# EAGLE board Seeeduino GPRS v1.0 (EAGLE 6.4)
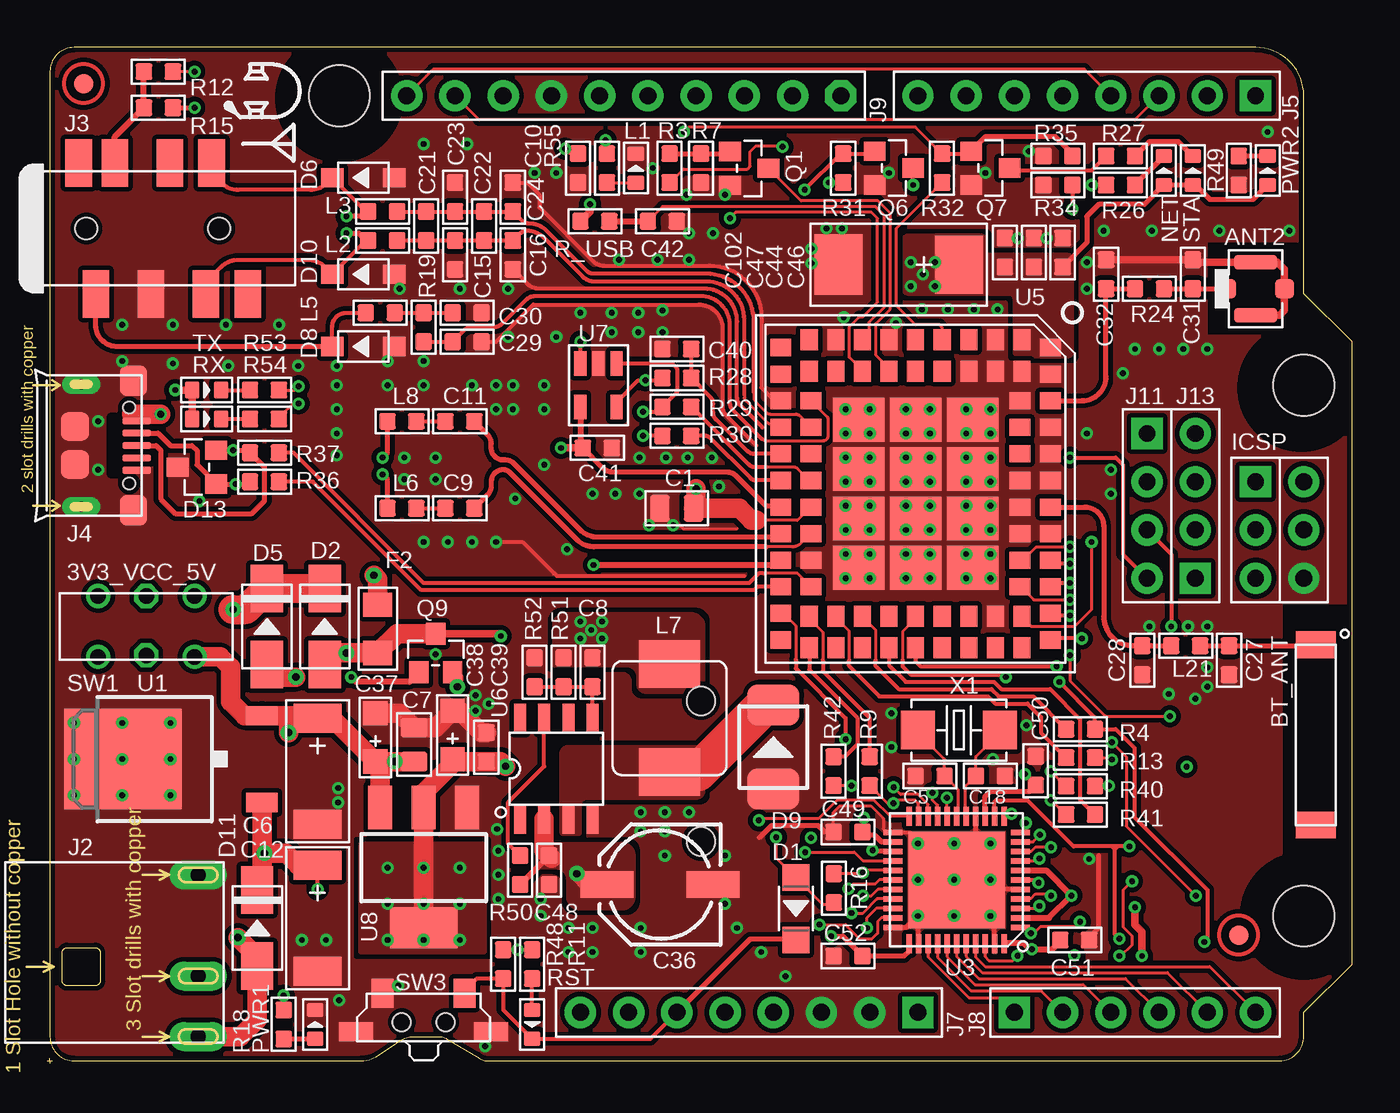
[diagram p3: board, top side]
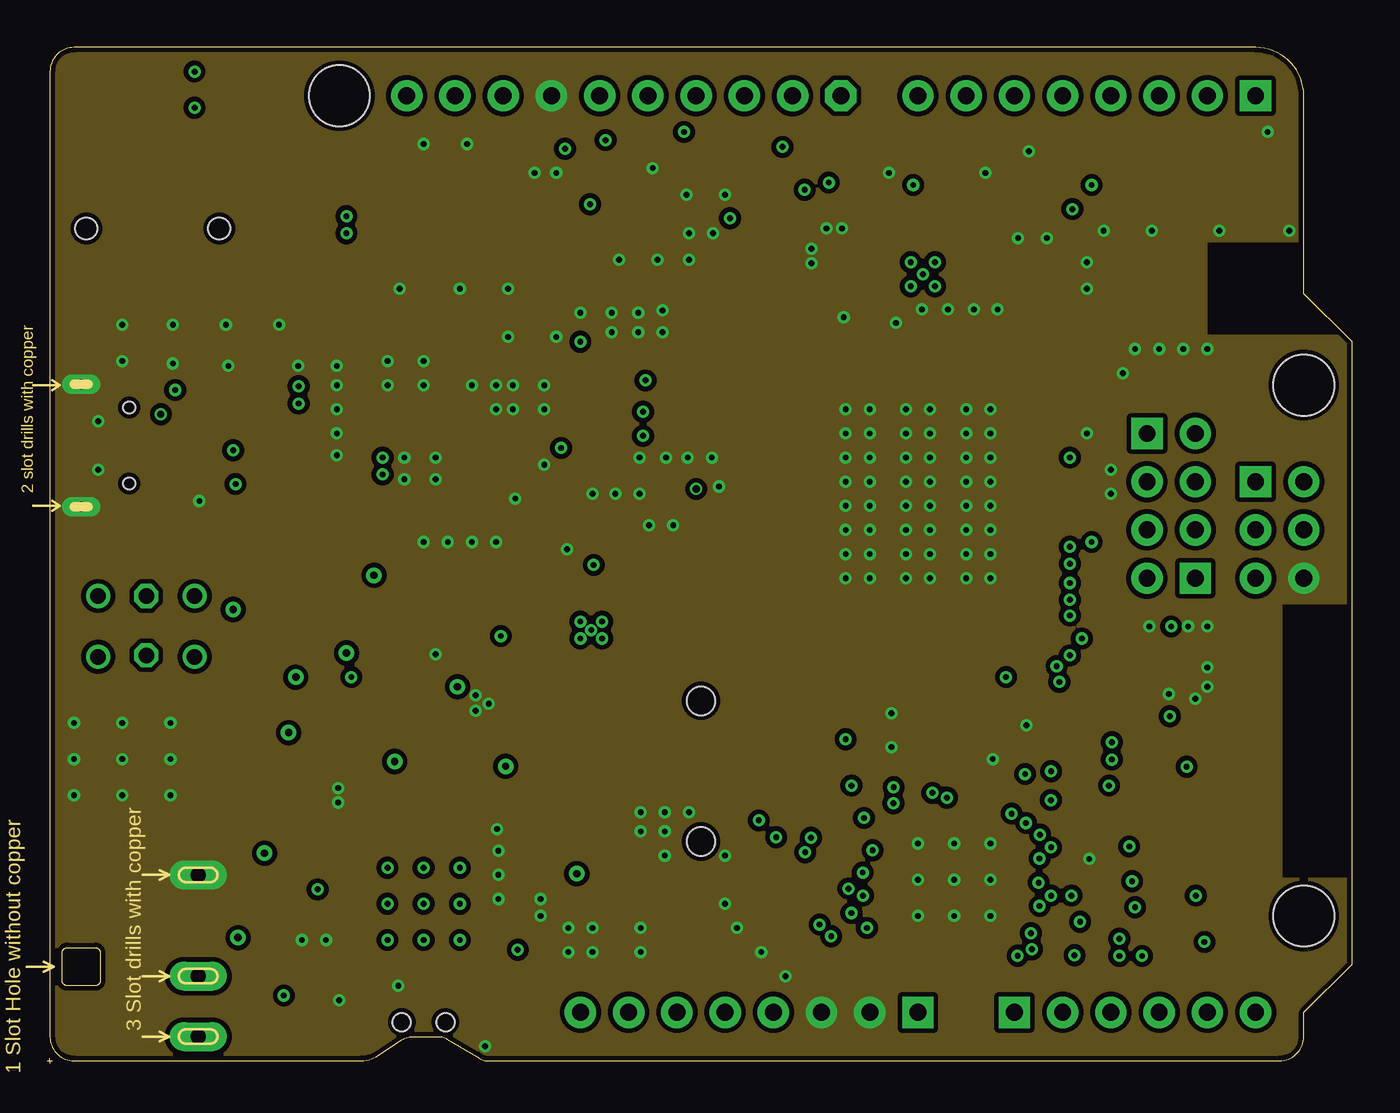
[diagram p4: board, inner layer GND]
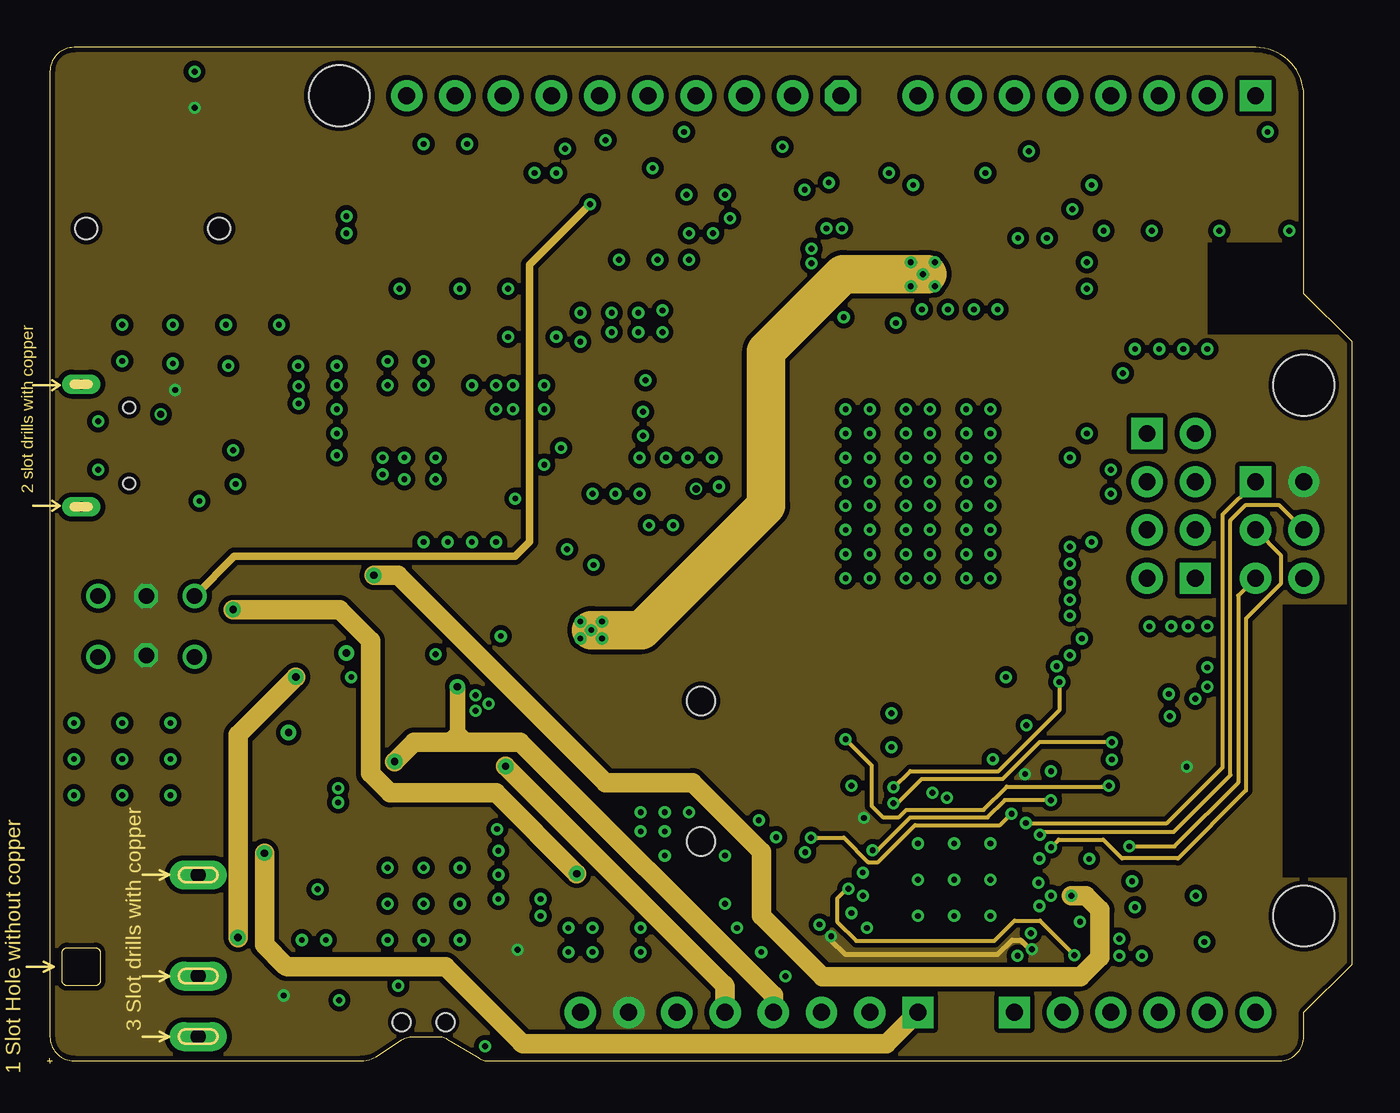
[diagram p5: board, inner layer VCC]
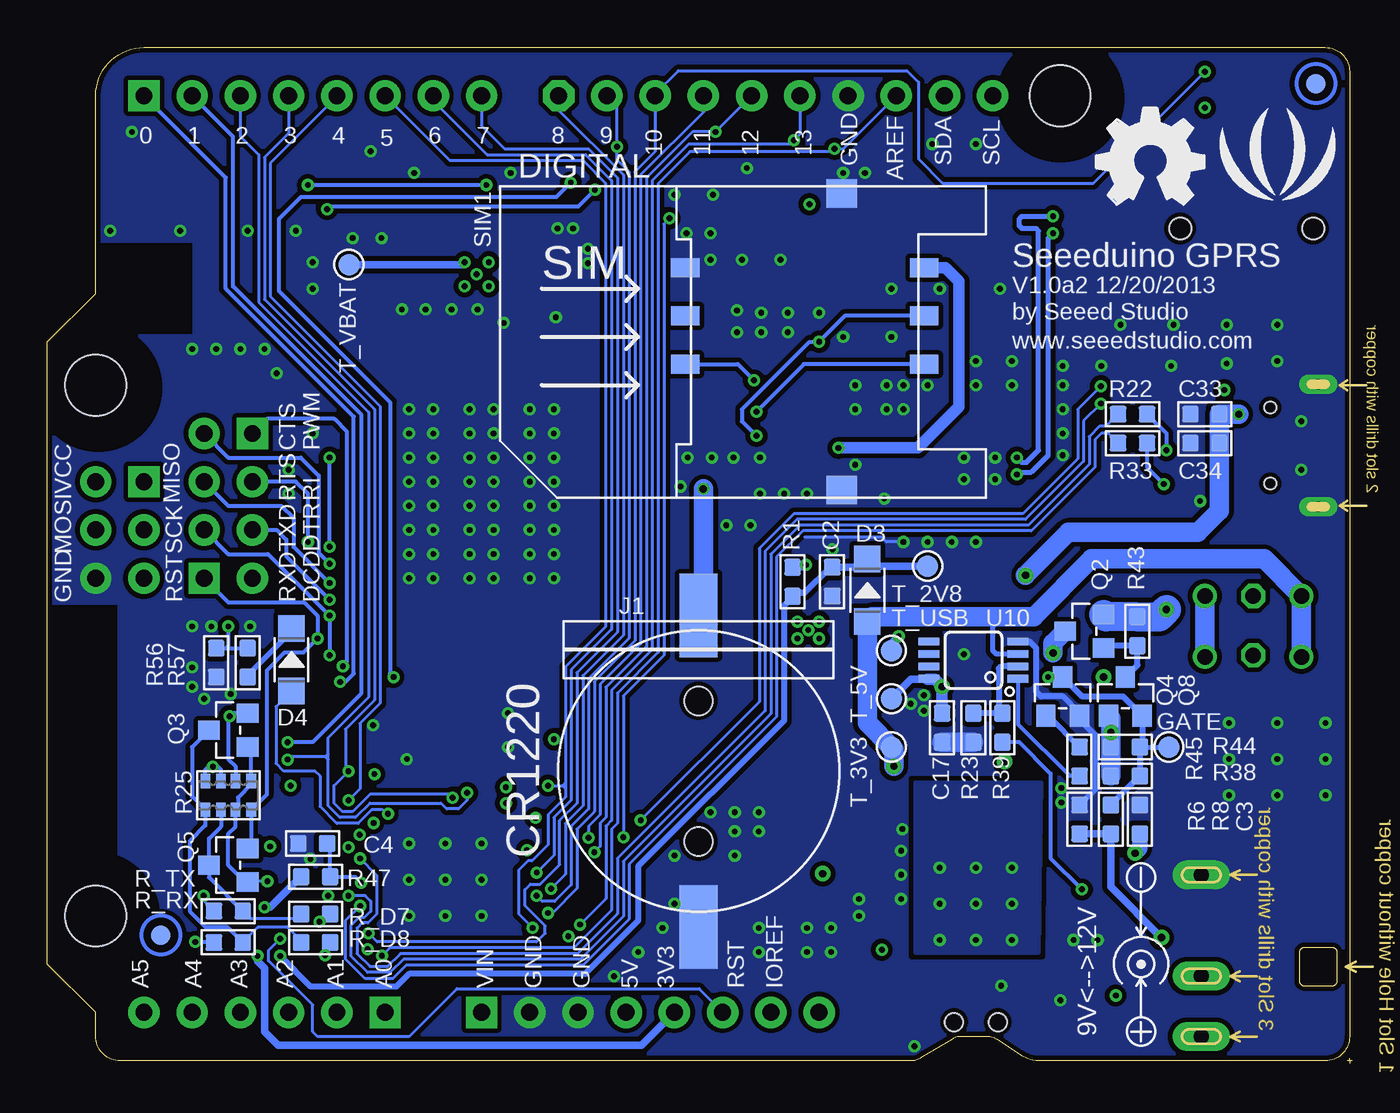
[diagram p6: board, bottom side, seen from below]

Size 68.71 x 53.47 mm. Coordinates in mm from the lower left corner, seen from the top.
Outline: 0.13,52.2 0.13,1.4
Outline: 0.13,1.4 arc90 1.4,0.13
Outline: 1.4,0.13 16.53,0.13 arc34 17.43,0.4 18.65,1.21 arc-34 19.25,1.4 20.57,1.4 arc-30 21.05,1.26 22.64,0.34 arc30 23.03,0.13 64.9,0.13
Outline: 64.9,0.13 arc90 66.17,1.4
Outline: 66.17,1.4 66.17,2.67 68.71,5.21 68.71,37.97 66.17,40.51 66.17,50.93
Outline: 66.17,50.93 arc90 63.63,53.47
Outline: 63.63,53.47 1.4,53.47
Outline: 1.4,53.47 arc90 0.13,52.2
Outline: 0.13,1.4 arc90 1.4,0.13
Outline: 64.9,0.13 arc90 66.17,1.4
Outline: 66.17,50.93 arc90 63.63,53.47
Outline: 1.4,53.47 arc90 0.13,52.2
Outline: 0,0.13 0.13,0.13
Outline: 0.13,0.13 0.25,0.13
Outline: 0.13,0.13 0.13,0.25
Outline: 0.13,0.13 0.13,0
Copper layers (1*2*15*16): Top 0.035mm / dielectric 0.2mm / GND 0.0175mm / dielectric 0.3mm / VCC 0.0175mm / dielectric 0.2mm / Bottom 0.035mm
Design rules "SeeedStudio_4layer_DRU_no_angle_20140221 *": minimum track width 4mil, minimum drill 0.2mm, track to track 6mil, track to pad 6mil, pad to pad 6mil, via to via 6mil, smd to smd 0mil, copper to edge 8mil, drill to drill 8mil, minimum pad ring 6mil, minimum via ring 4mil, stop-mask expansion 4mil, vias tented up to drill 100mil, thermal gap 10mil
Net classes: 0 default: width 0.152 mm, drill 0.305 mm, clearance 0.152 mm; 3 none3: width 0.203 mm, drill 0.305 mm, clearance 0.203 mm
Holes 3.2 mm at 15.37,50.93 66.17,35.69 66.17,7.75
tRestrict: area 63.1,4.7 to 69.2,10.8; area 63,32.5 to 69.1,38.6; area 12.3,47.8 to 18.4,53.8
bRestrict: area 12.3,47.8 to 18.4,53.8; area 63,32.5 to 69.1,38.6; area 63.1,4.7 to 69.2,10.8

## Footprints (pad centres in the part's own frame; a part is rotated, then mirrored left to right if it is on the bottom)
4P-U-FL = smd 1.016 x 1.016: D -1.524,0; GND3 1.524,0 | smd 2.286 x 0.762: GND1 0,1.397; GND2 0,-1.397
2P-9.5X2.1X1MM = smd 1.4 x 2.1: 1 -4.75,0; 2 4.75,0
C0805 = smd 1.016 x 1.397: 1 -0.889,0; 2 0.889,0
C0603 = smd 0.889 x 0.889: 1 -0.762,0; 2 0.762,0
AVX-C = smd 1.524 x 2.54: + -2.794,0; - 2.794,0
ELECTRO-SMD-D-5.6MM = smd 2.794 x 1.397: + 2.794,0; - -2.794,0
AVX-A = smd 1.27 x 1.27: + -1.27,0; - 1.27,0
AVX-D = smd 2.54 x 3.048: + -3.175,0 | smd 2.54 x 3.175: - 3.175,0
SOD123 = smd 1.397 x 1.397: + -1.651,0; - 1.651,0
SMA = smd 2.5 x 1.7: 1 2,0; 2 -2,0
SOD123-2.7X1.6 = smd 1.2 x 1.02: 1 -1.635,0; 2 1.635,0
SMB = smd 2.159 x 2.743: + -2.21,0; - 2.21,0
SOT23 = smd 1.016 x 1.143: 1 -0.889,-1.016; 2 0.889,-1.016; 3 0,1.016
1206 = smd 1.27 x 1.524: 1 -1.27,0; 2 1.27,0
TP_4545 = smd 1.143 x 1.143: T 0,0
2X3P-2.54 = drill 0.889 pad 1.651 square: 1 -1.27,2.54 | drill 0.889 pad 1.651: 2 -1.27,0; 3 -1.27,-2.54; 4 1.27,-2.54; 5 1.27,0; 6 1.27,2.54
SMD-CR1220-2 = smd 2 x 4.4: + 0,-8.2; - 0,8.2 | hole 1.5: 0,3.7; 0,-3.7
DC-404 = drill 0.813 pad 1.524 long: + 3.175,10.16; - -5.334,10.16; CDN 0,10.16
8P-3.5-SMD = smd 1.4 x 2.5: 1 2.8,-3.45; 2 5.7,-3.45; 3 8.6,-3.45; 4 8.9,3.45; 5 1.9,3.45; 6 3.8,3.45; 7 6.7,3.45; 8 10.8,-3.45 | hole 1.149: 2.3,0; 9.3,0
MICRO-USB = smd 0.381 x 1.524: 1 -1.3,-0.25; 2 -0.65,-0.25; 3 0,-0.25; 4 0.65,-0.25; 5 1.3,-0.25 | smd 1.6 x 1.397: S1 -3.4,-0.427; S6 3.4,-0.427 | drill 0.508 pad 1.016 long: S2 -3.226,-3.175; S5 3.226,-3.175 | smd 1.5 x 1.5: S3 -1,-3.5; S4 1,-3.5 | hole 0.635: -2,-0.65; 2,-0.65
8P-2.54-65/35MIL = drill 0.889 pad 1.651 square: 1 0,8.89 | drill 0.889 pad 1.651: 2 0,6.35; 3 0,3.81; 4 0,1.27; 5 0,-1.27; 6 0,-3.81; 7 0,-6.35; 8 0,-8.89
6P-2.54-65/35MIL = drill 0.889 pad 1.651 square: 1 0,6.35 | drill 0.889 pad 1.651: 2 0,3.81; 3 0,1.27; 4 0,-1.27; 5 0,-3.81; 6 0,-6.35
10P-2.54 = drill 0.889 pad 1.651 octagon: 1 0,11.43 | drill 0.889 pad 1.651: 2 0,8.89; 3 0,6.35; 4 0,3.81; 5 0,1.27; 6 0,-1.27; 7 0,-3.81; 8 0,-6.35; 9 0,-8.89; 10 0,-11.43
4P-65/35MIL = drill 0.889 pad 1.651 square: 1 0,3.81 | drill 0.889 pad 1.651: 2 0,1.27; 3 0,-1.27; 4 0,-3.81
LED-0603 = smd 0.762 x 0.889: + -0.762,0; - 0.762,0
L0603 = smd 0.889 x 0.889: 1 -0.762,0; 2 0.762,0
L0630 = smd 2.5 x 3.2: 1 -2.85,0; 2 2.85,0
R0603 = smd 0.889 x 0.889: 1 -0.762,0; 2 0.762,0
ROUND-MARK-1.0 = smd 1.016 x 1.016: P$1 0,0
1206-8-3.3X2.4 = smd 0.508 x 0.762: 1 -1.206,-0.762; 2 -0.381,-0.762; 3 0.381,-0.762; 4 1.206,-0.762; 5 1.206,0.762; 6 0.381,0.762; 7 -0.381,0.762; 8 -1.206,0.762
6P-1.8 = smd 1.5 x 1: 1 -6.3,-3.9; 2 -6.3,-1.36; 3 -6.3,1.18; 4 6.3,1.18; 5 6.3,-1.36; 6 6.3,-3.9 | smd 1.6 x 1.5: P1 -1.95,-7.8; P2 -1.95,7.8
6P-2CH-2.5-9.1X3.5X3.2H = drill 0.813 pad 1.27: CH1A -2.54,-1.6; CH1B 2.54,-1.6; CH2A -2.54,1.6; CH2B 2.54,1.6 | drill 0.813 pad 1.27 octagon: COM1 0,-1.6; COM2 0,1.524
4P-SMD-7X3.5X3.5H = smd 1.143 x 1.524: 1 -2.159,1.524; 2 2.159,1.524 | smd 1.778 x 1.016: S1 -3.556,-0.508; S2 3.556,-0.508 | hole 0.95: -1.15,0; 1.15,0
TO252 = smd 1.016 x 1.651: 1 -2.286,-4.826; 2 2.286,-4.826 | smd 5.3 x 6.2: 3 0,2.5
QFN44 = smd 1 x 0.3: 1 -3.35,2.5; 2 -3.35,2; 3 -3.35,1.5; 4 -3.35,1; 5 -3.35,0.5; 6 -3.35,0; 7 -3.35,-0.5; 8 -3.35,-1; 9 -3.35,-1.5; 10 -3.35,-2; 11 -3.35,-2.5; 23 3.35,-2.5; 24 3.35,-2; 25 3.35,-1.5; 26 3.35,-1; 27 3.35,-0.5; 28 3.35,0; 29 3.35,0.5; 30 3.35,1; 31 3.35,1.5; 32 3.35,2; 33 3.35,2.5 | smd 0.3 x 1: 12 -2.5,-3.35; 13 -2,-3.35; 14 -1.5,-3.35; 15 -1,-3.35; 16 -0.5,-3.35; 17 0,-3.35; 18 0.5,-3.35; 19 1,-3.35; 20 1.5,-3.35; 21 2,-3.35; 22 2.5,-3.35; 34 2.5,3.35; 35 2,3.35; 36 1.5,3.35; 37 1,3.35; 38 0.5,3.35; 39 0,3.35; 40 -0.5,3.35; 41 -1,3.35; 42 -1.5,3.35; 43 -2,3.35; 44 -2.5,3.35 | smd 5.08 x 5.08: TAB 0,0
88P-17.8X15.8X2.4H = smd 1.1 x 0.9: 1 -8.1,5.6; 2 -8.1,4.2; 3 -8.1,2.8; 4 -8.1,1.4; 5 -8.1,0; 6 -8.1,-1.4; 7 -8.1,-2.8; 8 -8.1,-4.2; 9 -8.1,-5.6; 22 8.1,-5.6; 23 8.1,-4.2; 24 8.1,-2.8; 25 8.1,-1.4; 26 8.1,0; 27 8.1,1.4; 28 8.1,2.8; 29 8.1,4.2; 30 8.1,5.6; 43 -6.45,5.6; 44 -6.45,4.2; 45 -6.45,2.8; 46 -6.45,1.4; 47 -6.45,0; 48 -6.45,-1.4; 49 -6.45,-2.8; 50 -6.45,-4.2; 51 -6.45,-5.6; 60 6.45,-5.6; 61 6.45,-4.2; 62 6.45,-2.8; 63 6.45,-1.4; 64 6.45,0; 65 6.45,1.4; 66 6.45,2.8; 67 6.45,4.2; 68 6.45,5.6 | smd 0.9 x 1.1: 10 -7.7,-7.1; 11 -6.3,-7.1; 12 -4.9,-7.1; 13 -3.5,-7.1; 14 -2.1,-7.1; 15 -0.7,-7.1; 16 0.7,-7.1; 17 2.1,-7.1; 18 3.5,-7.1; 19 4.9,-7.1; 20 6.3,-7.1; 21 7.7,-7.1; 31 7.7,7.1; 32 6.3,7.1; 33 4.9,7.1; 34 3.5,7.1; 35 2.1,7.1; 36 0.7,7.1; 37 -0.7,7.1; 38 -2.1,7.1; 39 -3.5,7.1; 40 -4.9,7.1; 41 -6.3,7.1; 42 -7.7,7.1; 52 -4.9,-5.5; 53 -3.5,-5.5; 54 -2.1,-5.5; 55 -0.7,-5.5; 56 0.7,-5.5; 57 2.1,-5.5; 58 3.5,-5.5; 59 4.9,-5.5; 69 4.9,5.5; 70 3.5,5.5; 71 2.1,5.5; 72 0.7,5.5; 73 -0.7,5.5; 74 -2.1,5.5; 75 -3.5,5.5; 76 -4.9,5.5 | smd 2.3 x 2.7: 77 -3.9,3; 78 -3.9,0; 79 -3.9,-3; 80 -1.3,-3; 81 1.3,-3; 82 3.9,-3; 83 3.9,0; 84 3.9,3; 85 1.3,3; 86 -1.3,3; 87 -1.3,0; 88 1.3,0
SOP8 = smd 0.635 x 1.524: 1 -1.905,-2.667; 2 -0.635,-2.667; 3 0.635,-2.667; 4 1.905,-2.667; 5 1.905,2.667; 6 0.635,2.667; 7 -0.635,2.667; 8 -1.905,2.667
SOT23-5L = smd 0.65 x 1.3: 1 0,1.15; 2 0.95,1.15; 3 1.9,1.15; 4 1.9,-1.15; 5 0,-1.15
SOT-223 = smd 1.27 x 2.286: 1 -2.286,-3.175; 2 0,-3.175; 3 2.286,-3.175 | smd 3.556 x 2.159: TER 0,3.175
MSOP8 = smd 1.1 x 0.4: 1 -2.477,0.975; 2 -2.477,0.325; 3 -2.477,-0.325; 4 -2.477,-0.975; 5 2.223,-0.975; 6 2.223,-0.325; 7 2.223,0.325; 8 2.223,0.975
2P-SMD-5X3.2 = smd 1.778 x 2.032: 1 -2.159,0; 2 2.159,0

## Placement (x,y rotation side)
ANT2  APZ01  [4P-U-FL]  63.63,40.77 0 top
BT_ANT  AN9520  [2P-9.5X2.1X1MM]  66.8,17.27 270 top
C1  4.7uF  [C0805]  33.15,29.21 0 top
C2  100nF  [C0603]  27.38,25.35 90 bottom
C3  100nF  [C0603]  11.18,12.83 270 bottom
C4  1uF  [C0603]  54.74,11.56 0 bottom
C5  8.2pF  [C0603]  46.48,15.11 0 top
C6  16v_47uF  [AVX-C]  14.22,15.37 270 top
C7  25V_10uF  [C0805]  19.3,16.76 90 top
C8  DNP  [C0603]  28.7,20.57 90 top
C9  39pF  [C0603]  21.72,29.21 180 top
C10  100nF  [C0603]  27.94,47.12 90 top
C11  39pF  [C0603]  21.72,33.78 180 top
C12  16v_47uF  [AVX-C]  14.22,7.62 270 top
C15  8.2pF  [C0603]  21.46,42.55 90 top
C16  39pF  [C0603]  24.51,42.55 90 top
C17  100nF  [C0603]  21.59,17.65 270 bottom
C18  8.2pF  [C0603]  49.66,15.11 180 top
C21  8.2pF  [C0603]  19.94,44.07 90 top
C22  39pF  [C0603]  22.99,44.07 90 top
C23  8.2pF  [C0603]  21.46,45.59 90 top
C24  39pF  [C0603]  24.51,45.59 90 top
C27  1.5pF  [C0603]  62.23,21.21 90 top
C28  DNP  [C0603]  57.66,21.21 90 top
C29  39pF  [C0603]  22.1,37.97 0 top
C30  39pF  [C0603]  22.1,39.5 180 top
C31  DNP  [C0603]  60.33,41.53 270 top
C32  DNP  [C0603]  55.75,41.53 270 top
C33  100nF  [C0603]  7.75,34.16 180 bottom
C34  10nF  [C0603]  7.75,32.64 180 bottom
C36  220uF_16V  [ELECTRO-SMD-D-5.6MM]  32.26,9.4 180 top
C37  DNP  [AVX-A]  17.27,17.14 90 top
C38  16V_10uF  [AVX-A]  21.34,17.27 90 top
C39  100nF  [C0603]  23.11,16.64 90 top
C40  22pF  [C0603]  33.15,37.59 0 top
C41  1uF  [C0603]  28.96,32.39 180 top
C42  1uF  [C0603]  32.39,44.32 180 top
C44  DNP  [C0603]  51.94,42.67 270 top
C46  DNP  [C0603]  53.47,42.67 270 top
C47  DNP  [C0603]  50.42,42.67 270 top
C48  100nF  [C0603]  26.42,10.16 90 top
C49  100nF  [C0603]  42.16,12.17 0 top
C50  100nF  [C0603]  52.04,15.39 270 top
C51  100nF  [C0603]  54.1,6.48 180 top
C52  100nF  [C0603]  42.16,5.64 0 top
C102  470uF_6.3V  [AVX-D]  44.83,42.04 180 top
D1  MBR0520LT1G  [SOD123]  39.42,8.13 270 top
D2  DNP  [SMA]  14.61,22.99 90 top
D3  DNP  [SOD123]  25.53,24.89 90 bottom
D4  MBR0520LT1G  [SOD123]  55.85,21.23 90 bottom
D5  1N5819  [SMA]  11.56,22.99 90 top
D6  CESD5V0D1  [SOD123-2.7X1.6]  16.64,46.61 180 top
D8  CESD5V0D1  [SOD123-2.7X1.6]  16.64,37.72 180 top
D9  SS54  [SMB]  38.23,16.64 90 top
D10  CESD5V0D1  [SOD123-2.7X1.6]  16.64,41.53 180 top
D11  1N5819  [SMA]  11.05,7.11 90 top
D13  CESD3V3AP  [SOT23]  7.87,31.37 90 top
F2  PPTC-500mA  [1206]  17.4,22.86 270 top
GATE  DNP  [TP_4545]  9.65,16.64 0 bottom
ICSP  2.54-2x3p male  [2X3P-2.54]  64.9,28.07 0 top
J1  CR1220  [SMD-CR1220-2]  34.42,15.37 180 bottom
J2  DC-044-AH  [DC-404]  -2.22,4.57 270 top
J3  8P-3.5mm-SMD  [8P-3.5-SMD]  -0.25,43.94 0 top
J4  MICRO-B-SMD_340005001  [MICRO-USB]  4.95,32.51 270 top
J5  HEADER-8P-65/35MIL  [8P-2.54-65/35MIL]  54.74,50.93 270 top
J7  HEADER-8P-65/35MIL  [8P-2.54-65/35MIL]  36.96,2.67 270 top
J8  HEADER-6P-65/35MIL  [6P-2.54-65/35MIL]  57.28,2.67 90 top
J9  HEADER-10P-2.54  [10P-2.54]  30.35,50.93 270 top
J11  DNP  [4P-65/35MIL]  57.91,29.34 0 top
J13  DNP  [4P-65/35MIL]  60.45,29.34 180 top
L1  GREEN  [LED-0603]  30.99,47.12 90 top
L2  120R_500mA  [L0603]  17.65,43.31 180 top
L3  120R_500mA  [L0603]  17.65,44.83 180 top
L5  120R_500mA  [L0603]  17.53,39.5 180 top
L6  68nH  [L0603]  18.67,29.21 180 top
L7  10uH  [L0630]  32.77,18.16 90 top
L8  68nH  [L0603]  18.67,33.78 180 top
L21  1.2nH  [R0603]  59.94,21.97 180 top
NET  RED  [LED-0603]  58.8,46.99 90 top
P5  DNP  [ROUND-MARK-1.0]  1.91,51.56 0 top
P6  DNP  [ROUND-MARK-1.0]  62.74,6.73 0 top
P7  DNP  [ROUND-MARK-1.0]  62.74,6.73 0 bottom
P8  DNP  [ROUND-MARK-1.0]  1.91,51.56 0 bottom
PWR1  GREEN  [LED-0603]  14.1,2.03 90 top
PWR2  GREEN  [LED-0603]  64.26,46.99 90 top
Q1  S9013  [SOT23]  36.96,47.1 270 top
Q2  NCE3407A  [SOT23]  14.1,22.73 90 bottom
Q3  2N7002  [SOT23]  59.18,17.53 90 bottom
Q4  2N7002  [SOT23]  15.24,19.3 0 bottom
Q5  2N7002  [SOT23]  59.18,10.41 90 bottom
Q6  S9013  [SOT23]  44.58,47.12 270 top
Q7  S9013  [SOT23]  49.66,47.12 270 top
Q8  2N7002  [SOT23]  11.94,19.3 0 bottom
Q9  NCE3407A  [SOT23]  20.45,21.59 0 top
R1  0R  [R0603]  29.46,25.34 90 bottom
R3  4.7K  [R0603]  32.77,47.12 90 top
R4  DNP  [R0603]  54.41,17.58 180 top
R6  1M  [R0603]  14.35,12.83 270 bottom
R7  100k  [R0603]  34.42,47.12 90 top
R8  DNP  [R0603]  12.7,12.83 270 bottom
R9  DNP  [R0603]  43.31,15.37 90 top
R11  1k  [R0603]  25.53,5.21 270 top
R12  DNP  [R0603]  5.84,52.2 0 top
R13  DNP  [R0603]  54.41,16.08 180 top
R15  DNP  [R0603]  5.84,50.29 180 top
R16  DNP  [R0603]  41.41,9.21 90 top
R18  1k  [R0603]  12.45,2.03 270 top
R19  68R  [R0603]  19.81,38.73 90 top
R22  0R  [R0603]  11.56,34.16 180 bottom
R23  100k  [R0603]  19.94,17.65 90 bottom
R24  0R  [R0603]  58.04,40.77 180 top
R25  4.7k  [1206-8-3.3X2.4]  59.18,14.1 0 bottom
R26  470R  [R0603]  56.52,46.23 180 top
R27  470R  [R0603]  56.52,47.75 180 top
R28  22R  [R0603]  33.15,36.07 0 top
R29  22R  [R0603]  33.15,34.54 180 top
R30  22R  [R0603]  33.15,33.02 180 top
R31  4.7K  [R0603]  41.91,47.12 270 top
R32  4.7K  [R0603]  47.12,47.12 270 top
R33  0R  [R0603]  11.56,32.64 180 bottom
R34  100k  [R0603]  53.21,46.23 180 top
R35  100k  [R0603]  53.21,47.75 180 top
R36  DNP  [R0603]  11.43,30.61 180 top
R37  DNP  [R0603]  11.43,32.13 180 top
R38  100k  [R0603]  11.94,15.11 180 bottom
R39  100k  [R0603]  18.41,17.65 270 bottom
R40  DNP  [R0603]  54.41,14.58 0 top
R41  DNP  [R0603]  54.41,13.08 0 top
R42  DNP  [R0603]  41.4,15.37 90 top
R43  100k  [R0603]  11.3,22.73 90 bottom
R44  100k  [R0603]  11.94,16.64 180 bottom
R45  1k  [R0603]  14.35,15.88 270 bottom
R47  DNP  [R0603]  54.58,9.8 0 bottom
R48  10K  [R0603]  24,5.21 270 top
R49  1k  [R0603]  62.74,46.99 90 top
R50  100k  [R0603]  24.89,10.16 270 top
R51  24k_1%  [R0603]  27.18,20.57 270 top
R52  10k_1%  [R0603]  25.65,20.57 90 top
R53  1k  [R0603]  11.43,35.43 180 top
R54  1k  [R0603]  11.43,33.91 180 top
R55  1k  [R0603]  29.46,47.12 90 top
R56  10K  [R0603]  59.82,21.08 90 bottom
R57  4.7K  [R0603]  58.17,21.08 270 bottom
R_D7  0R  [R0603]  54.58,7.85 180 bottom
R_D8  0R  [R0603]  54.58,6.35 180 bottom
R_RX  DNP  [R0603]  59.18,6.35 0 bottom
R_TX  DNP  [R0603]  59.18,8 0 bottom
R_USB  DNP  [R0603]  28.83,44.32 180 top
RST  RED  [LED-0603]  25.53,2.03 270 top
RX  RED  [LED-0603]  8.38,33.91 0 top
SIM1  ST-SIM-004B  [6P-1.8]  28.83,37.97 180 bottom
STA  GREEN  [LED-0603]  60.33,46.99 90 top
SW1  SWITCH-2CH-6P  [6P-2CH-2.5-9.1X3.5X3.2H]  5.21,22.99 180 top
SW3  BUTTON-4P-REINFORCE'TS-118E'  [4P-SMD-7X3.5X3.5H]  19.81,2.16 0 top
T_2V8  DNP  [TP_4545]  22.35,26.16 90 bottom
T_3V3  DNP  [TP_4545]  24.26,16.64 90 bottom
T_5V  DNP  [TP_4545]  24.26,19.18 90 bottom
T_USB  DNP  [TP_4545]  24.26,21.72 0 bottom
T_VBAT  DNP  [TP_4545]  52.83,42.04 90 bottom
TX  RED  [LED-0603]  8.38,35.43 0 top
U1  CJ78M05  [TO252]  6.48,16 90 top
U3  ATMEGA32U4-MUR  [QFN44]  47.88,9.64 180 top
U5  SIM800H  [88P-17.8X15.8X2.4H]  45.72,29.97 270 top
U6  TD1410  [SOP8]  26.8,15.49 0 top
U7  ESDA6V1SC5  [SOT23-5L]  28.07,35.69 0 top
U8  CJT1117-3.3  [SOT-223]  19.81,10.29 180 top
U10  LMV358DGKR  [MSOP8]  20.07,21.21 180 bottom
U$36  [LOGO_SILK]  3.94,47.12 0 bottom
U$42  [OSHW_FILLX200_NOTEXT]  13.46,45.21 0 bottom
X1  16MHz  [2P-SMD-5X3.2]  48.01,17.53 180 top

## Tracks (layer width: path | path; a pad name or v marks a point on that pad's centre or on a via)
3V3  (via drill 0.3 pad 0.64, 0.38 pad 0.81)
  Top 0.406: v57.65,5.64 57.65,6.92 57.28,7.29 v57.28,8.2
  Top 1.016: U8.TER U8.2 19.81,14.22 21.34,15.75 C38.+ 21.46,15.88 C39.1 23.88,15.88 v24.13,15.62
  VCC 1.016: v24.13,15.62 35.61,4.14 arc-45 35.69,3.96 J7.5
  Bottom 0.254: U10.3 18.74,21.53 18.92,21.72 18.92,22.99 | 18.92,22.99 18.92,23.37 18.8,23.49 | 18.92,22.99 18.67,23.24 | 18.92,22.99 19.18,23.24
  Bottom 0.406: J7.5 37.43,0.93 56.55,0.93 57.28,1.65 57.28,4.98 57.65,5.35 v57.65,5.64 | R47.1 55.37,9.8 56.97,8.2 v57.28,8.2
  Bottom 1.016: v24.13,15.62 24.13,16.51 T_3V3.T 25.53,17.91 D3.+ 25.27,23.49 18.8,23.49 16.76,23.49 13.72,26.54 4.62,26.54 SW1.CH1B SW1.CH2B
  other vias: 19.81,6.48 19.81,8.38 19.81,10.29 21.72,10.29 21.72,8.38 21.72,6.48 17.91,6.48 17.91,8.38 17.91,10.29
  pour Top (isolate 0.254, no thermals): 16.51,11.56 22.99,11.56 22.99,5.84 16.51,5.84
  pour Bottom (isolate 0.254, no thermals): 16.38,14.73 22.99,14.73 22.99,5.84 16.51,5.84
!RES  (via drill 0.3 pad 0.64)
  Top 0.152: U5.49 42.92,36.46 42.23,37.15 42.23,38.76 42.77,39.29 42.95,39.29 43.71,40.06 43.71,44.48 43.41,44.78 36.25,44.78 v35.94,44.48 | 41.19,8.45 R16.1 41.33,8.36 40.82,8.36 39.42,9.75 D1.+ | D1.+ 39.4,9.78 | v38.38,11.89 38.38,10.82 D1.+
  Bottom 0.152: v35.94,44.48 36.25,44.17 36.25,21.46 38.38,19.33 v38.38,11.89
!RESET  (via drill 0.3 pad 0.64)
  Top 0.203: U3.13 49.88,13.76 49.96,13.84 51.6,13.84 54.04,11.41 56.06,11.41 | J7.6 31.75,1.27 RST.- 24,2.79 R48.2 22.61,4.44 22.1,3.94 22.1,3.81 SW3.2 | v56.97,11.41 56.36,11.41 | 56.36,11.41 56.21,11.41 | 56.21,11.41 56.06,11.41 | v56.45,6.54 56.21,6.78 56.21,11.25 | 56.21,11.25 56.21,11.41 | 56.21,11.25 56.36,11.41 | 56.21,11.25 56.06,11.41
  Top 0.254: D1.- 39.37,6.53 37.01,6.53 J7.6
  VCC 0.203: ICSP.3 62.71,24.61 62.71,14.76 59.36,11.41 v56.97,11.41
  Bottom 0.152: J7.6 34.39,3.91 47.14,3.91 49.66,1.4 54.48,1.4 54.74,1.65 54.74,3.06 57.06,5.38 57.06,5.93 v56.45,6.54
ANT
  Top 0.254: U5.40 54.48,34.87 arc90 55.75,36.14 C32.2 R24.2
AREF  (via drill 0.3 pad 0.64)
  Top 0.152: U3.42 49.38,5.61 49.59,5.4 50.84,5.4 v51.09,5.65 | C10.2 27.51,47.88 v27.25,48.13
  Bottom 0.152: v51.09,5.65 50.67,6.07 40.97,6.07 38.99,8.05 38.99,12.32 38.68,12.62 38.68,19.48 36.55,21.61 36.55,46.3 34.87,47.98 27.41,47.98 v27.25,48.13 26.8,48.13 J9.8
BT_ANT
  Top 0.254: U5.36 54.63,29.27 arc-90 55.63,28.28 55.63,23.52 arc90 57.18,21.97 C28.2 | 58.12,21.97 C28.2 | C28.2 L21.2
D14/PB3/MISO  (via drill 0.3 pad 0.64)
  Top 0.203: U3.11 51.36,12.14 51.54,12.32 v51.54,12.64
  VCC 0.203: v51.54,12.64 58.97,12.64 61.9,15.57 61.9,28.88 ICSP.1
D15/PB1/SCK  (via drill 0.3 pad 0.64)
  Top 0.152: U3.9 51.81,11.14 52.02,11.35 v52.86,11.35
  VCC 0.203: ICSP.2 64.95,26.75 64.95,25.22 63.12,23.39 63.12,14.35 59.53,10.77 56.59,10.77 55.6,11.76 53.26,11.76 v52.86,11.35
D16/PB2/MOSI  (via drill 0.3 pad 0.64)
  Top 0.152: U3.10 51.9,11.64 v52.27,12.01
  VCC 0.203: ICSP.5 64.85,29.39 63.12,29.39 62.31,28.57 62.31,15.16 59.31,12.17 52.4,12.17 52.27,12.04 v52.27,12.01
D17/PB0/RXLED  (via drill 0.3 pad 0.64)
  Top 0.152: R54.1 12.32,33.91 | 12.32,33.91 12.42,33.91 | v13.23,34.72 12.93,34.72 12.32,34.11 12.32,33.91 | U3.8 52.12,10.64 v52.25,10.77
  Bottom 0.152: v13.23,34.72 14.15,33.81 14.15,31.67 17.2,28.63 29.23,28.63 30.91,26.95 30.91,18.54 38.68,10.77 38.68,7.86 40.78,5.77 50.11,5.77 50.79,5.09 51.72,5.09 52.4,5.77 52.4,7.1 52.12,7.38 51.83,7.38 51.38,7.83 51.38,9.9 v52.25,10.77
D+  (via drill 0.3 pad 0.64)
  Top 0.152: U3.4 51.25,8.66 51.79,8.66 52.04,8.91 52.76,8.91 v52.86,8.81
  Bottom 0.152: v52.86,8.81 51.97,8.81 51.68,8.53 51.68,7.99 51.99,7.68 52.29,7.68 52.71,7.26 52.71,5.62 51.86,4.77 50.65,4.77 49.96,5.46 40.64,5.46 38.38,7.72 38.38,10.62 30.61,18.39 30.61,26.8 29.08,28.32 17.04,28.32 13.84,31.52 13.84,32.98 13.3,33.53 12.95,33.53 R22.2
D-  (via drill 0.3 pad 0.64)
  Top 0.152: U3.3 52.12,8.14 v52.25,8.27
  Bottom 0.152: v52.25,8.27 53.01,7.51 53.01,5.47 51.97,4.44 50.53,4.44 49.81,5.16 40.5,5.16 38.08,7.58 38.08,10.46 30.3,18.24 30.3,26.64 28.93,28.02 16.89,28.02 13.54,31.37 13.54,32.82 13.21,33.15 12.83,33.15 R33.2
DC_5V  (via drill 0.3 pad 0.64, 0.38 pad 0.81)
  Top 0.406: v28.57,45.21 28.57,44.83 R_USB.2
  Top 0.61: v21.59,19.81 21.59,20.32 Q9.2
  Top 1.016: Q8.1 U1.2 10.39,18.29 9.65,19.03 9.65,20.83 9.09,21.39 SW1.CH2A | Q8.1 14.1,18.29 C6.+ 14.99,18.16 C37.+ 17.4,15.88 | v12.7,17.4 12.7,18.16 Q8.1 | C7.1 v18.29,15.88 17.4,15.88 | U8.3 17.53,15.75 17.4,15.88
  VCC 0.406: v28.57,45.21 25.4,42.04 25.4,27.43 24.64,26.67 9.83,26.67 SW1.CH1A
  VCC 0.813: v21.59,19.81 21.59,17.4 | 21.59,17.4 21.59,16.89 | 21.59,17.4 21.08,16.89 | 21.59,17.4 | 21.59,17.4 22.1,16.89
  VCC 1.016: v18.29,15.88 19.3,16.89 21.08,16.89 21.59,16.89 24.9,16.89 38.23,3.56 J7.4
  Bottom 0.305: 22.22,20.19 22.25,20.19 U10.8
  Bottom 0.406: 22.22,20.19 23.24,20.19 T_5V.T
  Bottom 0.61: C17.1 v21.59,19.81 21.97,20.19 22.22,20.19 22.35,20.19
  Bottom 1.016: R38.2 R44.2 v12.7,17.4 12.7,18.16 Q8.1 | SW1.CH2A SW1.CH1A
DC_GATE  (via drill 0.3 pad 0.64)
  Top 0.305: Q9.1 19.05,20.07 16.26,20.07 v16,20.32
  Bottom 0.254: R44.1 GATE.T
  Bottom 0.305: R8.1 R38.1 R44.1 11.05,16.76 Q8.2 12.07,19.3 14.22,19.3 Q4.3 v16,20.32
DC_VIN  (via drill 0.3 pad 0.64, 0.38 pad 0.81)
  Top 0.203: v14.22,9.14 14.22,10.16 14.35,10.29 C12.+
  Top 1.016: U1.1 11.3,10.92 | 11.3,10.92 11.3,9.37 D11.1 | C12.+ 13.21,10.41 12.57,11.05 v11.43,11.05 11.3,10.92
  VCC 1.016: J7.1 44.2,1.02 25.12,1.02 arc-45 24.95,1.09 20.95,5.08 12.68,5.08 arc-45 12.5,5.15 11.43,6.22 v11.43,11.05
  Bottom 0.203: v14.22,9.14 15.88,10.79 15.88,15.24 17.53,16.89 R39.2
  Bottom 0.813: C3.2 11.18,11.3 v11.43,11.05
FM_ANT
  Top 0.203: D8.2 15,38.77 arc-90 15.73,39.5 L5.2
  Top 0.254: D8.2 3.68,37.72 arc-90 2.54,38.86 J3.1
FM_ANT_N
  Top 0.152: U5.57 40.19,27.87 39.68,27.36 arc-45 39.23,27.18 37.85,27.18
  Top 0.254: 37.85,27.18 28.78,27.18 arc-45 27.89,27.55 24.33,31.11 arc45 24,31.24 arc90 23.37,30.61 23.37,30.36 arc-45 23.18,29.91 C9.1
FM_ANT_P
  Top 0.254: C11.1 23.18,33.08 arc-45 23.37,32.63 23.37,32.39 arc90 24,31.75 24.12,31.75 arc-45 24.57,31.56 28.08,28.06 arc45 28.97,27.69 38.23,27.69 38.35,27.56 38.62,27.82 U5.17
FM_N  (via drill 0.3 pad 0.64)
  Top 0.203: L2.2 16.78,43.31 D10.2 14.61,41.92 arc45 13.71,42.29 10.05,42.29 arc45 9.15,41.92 8.35,41.11 J3.3
  Top 0.254: L6.2 17.91,30.73 v17.65,30.99 | v15.75,43.69 16.4,43.69 16.78,43.31
  Bottom 0.254: v17.65,30.99 17.53,31.11 16.89,31.11 16,32 16,43.43 v15.75,43.69
FM_P  (via drill 0.3 pad 0.64)
  Top 0.152: 16.78,44.83 L3.2
  Top 0.203: 16.78,44.83 D6.2 14.74,46.35 arc-45 13.84,45.97 10.05,45.97 arc-45 9.15,46.35 8.65,46.85 J3.4
  Top 0.254: L8.2 17.91,32.13 v17.65,31.88 | v15.75,44.58 16.64,44.58 L3.2
  Bottom 0.254: v17.65,31.88 17.4,31.62 17.14,31.62 16.51,32.26 16.51,43.82 16.64,43.94 17.4,43.94 17.53,44.07 17.53,44.45 17.4,44.58 v15.75,44.58
GND  (via drill 0.3 pad 0.64)
  Top 0.152: C49.1 41.4,13.21 41.73,13.54 43.37,13.54 44.02,12.88 44.02,12.32 44.17,12.17 44.5,12.17 U3.23 | v32.96,28.32 33.27,28.32 33.46,28.13 36.32,28.13
  Top 0.203: 24.64,46.36 C24.2 25.27,46.36 25.91,45.72 25.91,45.04 28.73,42.22 arc45 29.3,41.98 34.87,41.98 arc-90 37.59,39.27 37.59,35.56 38.23,34.93 38.57,34.93 U5.12 | 37.65,33.47 36.48,34.65 arc-45 36.32,35.02 36.32,39.04 arc90 34.59,40.77 25.88,40.77 arc-45 25.27,41.02 C16.1 | C29.2 23.62,37.97 25.58,39.93 34.29,39.93 arc-90 35.56,38.66 35.56,34.5 arc45 35.71,34.14 37.34,32.51 | U3.23 45.39,12.14 46.74,10.79 | v23.62,27.43 25.02,27.43 26.67,25.78 26.7,25.78 26.82,25.65 36.7,25.65
  Top 0.254: U3.5 48.38,9.14 | 48.38,9.14 U3.TAB 47.87,9.65 v47.75,9.65 | U3.43 49.88,7.64 48.38,9.14 | U3.35 45.88,7.78 | 45.88,7.78 v47.75,9.65 | U3.33 45.24,7.14 45.88,7.78 | U3.15 48.88,10.78 v47.75,9.65 | 46.74,10.79 46.74,10.67 v47.75,9.65 | C51.1 54.86,6.6 55.37,7.11 55.37,10.92 | C49.1 40.92,12.17 40.58,12.5 38.13,12.5 37.49,11.86
  Top 0.406: ANT2.GND2 64.9,39.37 65.15,39.62 ANT2.GND3 65.15,41.78 64.77,42.16 ANT2.GND1 60.45,42.16 C31.1 C32.1
  Top 1.016: C37.- 18.54,18.41 C7.2 20.45,17.65 C38.- 21.72,18.54 22.86,17.4 C39.2
  Bottom 0.152: v23.62,27.43 24.51,27.43 24.77,27.69 28.83,27.69
  Bottom 0.305: U10.4 16.98,22.18 16.64,21.84 16.64,19.56 16.38,19.3 15.24,19.3 14.35,18.41 Q4.2 14.35,18.1 13.52,17.26 13.52,14.42 R6.1
  Bottom 1.016: R23.1 C17.2
  other vias: 41.02,43.94 41.85,43.94 44.32,46.86 49.4,46.86 40.23,42.88 46.05,39.67 47.42,39.67 48.79,39.67 50.04,39.67 42.04,34.42 43.31,34.42 42.04,33.15 43.31,33.15 42.04,31.88 43.31,31.88 42.04,30.61 43.31,30.61 45.21,31.88 46.48,31.88 45.21,30.61 46.48,30.61 48.39,31.88 49.66,31.88 48.39,30.61 49.66,30.61 45.21,34.42 46.48,34.42 45.21,33.15 46.48,33.15 48.39,34.42 49.66,34.42 48.39,33.15 49.66,33.15 42.04,29.34 43.31,29.34 42.04,28.07 43.31,28.07 45.21,29.34 46.48,29.34 45.21,28.07 46.48,28.07 48.39,29.34 49.66,29.34 48.39,28.07 49.66,28.07 42.04,26.8 43.31,26.8 42.04,25.53 43.31,25.53 45.21,26.8 46.48,26.8 45.21,25.53 46.48,25.53 48.39,26.8 49.66,26.8 48.39,25.53 49.66,25.53 6.48,16 3.94,16 1.4,16 1.4,17.91 1.4,14.1 3.94,14.1 3.94,17.91 6.48,17.91 6.48,14.1 32.39,38.48 29.72,38.48 28.7,29.97 24.26,40.77 21.72,40.77 18.54,40.77 19.81,48.39 22.1,48.39 2.67,31.24 2.67,33.78 8,29.59 15.24,32 18.8,31.88 18.8,30.73 20.45,30.73 20.45,31.88 22.54,18.54 20.45,21.53 22.54,19.37 23.24,18.92 15.3,14.48 15.3,13.72 13.4,6.48 14.67,6.48 18.48,4.06 15.37,3.3 59.05,19.43 61.09,19.81 60.07,22.99 58.04,22.99 56.01,29.97 54.74,33.15 56.64,36.32 54.74,40.77 54.74,42.16 55.63,43.82 58.17,43.82 57.28,37.59 58.55,37.59 59.82,37.59 61.09,37.59 25.97,7.75 25.97,8.64 29.91,29.97 51.12,43.43 52.64,43.43 3.94,36.96 44.68,38.96 33.78,43.69 31.69,28.32 51.69,48.01 64.26,49.02 33.66,45.72 65.41,43.82 56.01,31.24 44.45,18.41 44.45,16.64 61.09,22.99 60.45,19.18 61.09,20.83 40.23,42.11 41.94,39.27 3.94,38.86 9.53,36.7 12.19,38.86 6.6,36.83 33.78,42.29 61.72,43.82 23.05,0.89 21.08,27.43 22.35,27.43 19.81,27.43 24.64,29.72 26.16,31.5 23.62,34.42 19.81,35.69 15.24,33.15 23.75,11.18 23.75,9.91 23.75,8.64 31.24,13.21 32.51,13.21 33.78,13.21 31.24,12.19 32.51,12.19 32.51,10.92 27.43,7.11 28.7,7.11 28.7,5.84 27.43,5.84 31.24,5.84 23.69,12.32 31.18,29.97 31.18,31.88 32.58,31.88 33.72,31.88 34.99,31.88 35.37,30.35 35.69,10.92 35.69,8.38 36.32,7.11 37.59,5.84 38.86,4.57 49.78,16 51.56,17.78 45.85,11.56 47.75,11.56 49.66,11.56 49.66,9.65 49.66,7.75 47.75,7.75 45.85,7.75 45.85,9.65 54.86,10.74 19.81,36.96 23.62,35.69 29.72,39.5 32.39,39.62 32.13,42.29 35.05,43.69 35.69,45.72 30.1,42.29 26.8,46.86 25.65,46.86 13.21,36.7 15.24,36.7 27.37,27.05 24.51,34.42 24.51,35.69 24.26,38.23 6.6,38.86 9.4,38.86 15.24,34.42 15.24,35.69 17.91,35.69 26.8,38.23 28.07,39.5 31.11,39.5 31.11,38.48 26.16,35.69 26.16,34.42 22.35,35.69 17.91,36.96 31.88,47.12 31.24,7.11
  pour Top (isolate 0.254, no thermals): 0.25,19.3 8.38,19.3 8.38,12.7 0.25,12.7
  pour Bottom (isolate 0.254, rank 6, no thermals): 0.13,54.1 66.8,54.1 66.8,43.31 60.96,43.31 60.96,38.23 69.98,38.23 69.98,24.26 64.9,24.26 64.9,9.65 69.98,9.65 69.98,0.13 0.13,0.13
  pour Top (isolate 0.254, rank 6, no thermals): 0.13,54.1 66.8,54.1 66.8,43.31 60.96,43.31 60.96,38.23 69.98,38.23 69.98,24.26 64.9,24.26 64.9,9.65 69.98,9.65 69.98,0.13 0.13,0.13
  pour GND (isolate 0.254, no thermals): 0.13,54.1 66.8,54.1 66.8,43.31 60.96,43.31 60.96,38.23 69.98,38.23 69.98,24.26 64.9,24.26 64.9,9.65 69.98,9.65 69.98,0.13 0.13,0.13
HRXD
  Bottom 0.152: R_D8.2 55.35,6.43 56.06,7.14 57.63,7.14 R_RX.2
  Bottom 0.203: Q3.3 61.09,16.64 61.09,14.03 R25.1 60.39,12.51 61.21,11.68 61.21,8 60.39,7.17 59.25,7.17 R_RX.2
HTXD
  Bottom 0.152: R_D7.2 55.6,7.59 58.01,7.59 R_TX.2
  Bottom 0.203: R25.2 59.56,12.45 60.2,11.81 Q5.3 60.2,9.78 R_TX.2
I/O  (via drill 0.3 pad 0.64)
  Top 0.152: 30,34.57 U7.4
  Top 0.203: R28.1 32.26,35.94 v31.5,35.94 31.11,35.94 30,34.82 30,34.57
  Bottom 0.203: SIM1.4 32.35,36.79 v31.5,35.94
MIC_P
  Top 0.152: 37.64,32.85 arc45 37.84,32.77 40.86,32.77 arc90 41.12,33.03 41.12,33.87 arc45 41.05,34.04 U5.52
  Top 0.203: 37.64,32.85 36.05,34.43 arc-45 35.94,34.7 35.94,38.83 arc90 34.39,40.38 25.73,40.38 arc45 25.16,40.14 23.94,38.93 arc-45 23.48,38.73 22.31,38.73 arc45 21.95,38.58 C29.1 R19.1
N$2  (via drill 0.3 pad 0.64)
  Top 0.203: Q6.1 43.43,47.88 R31.1 41.78,47.88 v39.88,45.97 | R34.1 v53.98,44.96
  Bottom 0.203: v39.88,45.97 40.77,45.09 53.85,45.09 v53.98,44.96
N$3  (via drill 0.3 pad 0.64)
  Top 0.203: v45.59,46.23 Q6.3 | R26.2 v54.99,46.23
  Bottom 0.203: v54.99,46.23 v45.59,46.23
N$4
  Bottom 0.254: D4.- 55.86,22.73 58.04,20.55 58.04,20.45 R57.2
N$5  (via drill 0.3 pad 0.64)
  Top 0.305: v28.77,26.23 38.37,26.23 U5.18
  Top 0.406: 38.56,26.42 U5.18
  Bottom 0.305: R1.2 28.89,26.1 v28.77,26.23
N$7
  Bottom 0.305: U10.2 18.49,20.88 18.6,20.77 18.6,18.6 R39.1 R23.2
N$8
  Top 0.305: J3.6 3.55,48.76 R15.2 R12.1
N$9
  Top 0.203: U5.19 37.39,25.07 37.21,24.89 19.68,24.89 13.97,30.61 R36.1
N$10
  Top 0.203: L8.1 C11.2
N$11
  Top 0.254: R3.2 R7.2 35.83,47.88 Q1.1
N$12
  Top 0.203: L6.1 C9.2
N$13  (via drill 0.3 pad 0.64)
  Top 0.203: R30.2 v31.37,33.02 | U7.1 v28.07,37.97
  Bottom 0.203: v31.37,33.02 32.13,33.78 32.13,34.42 28.57,37.97 v28.07,37.97 26.71,39.33 SIM1.2
N$14  (via drill 0.3 pad 0.64)
  Top 0.203: v31.37,34.29 32.13,34.29 R29.2 33.15,35.31 33.15,36.58 32.89,36.84 U7.3
  Bottom 0.203: v31.37,34.29 28.87,36.79 SIM1.3
N$16
  Top 0.203: RST.+ R11.2
N$17
  Top 0.152: U5.59 39.51,25.78 37.72,25.78
  Top 0.203: 37.72,25.78 37.47,25.78 36.96,25.27 19.81,25.27 12.95,32.13 R37.1
N$18  (via drill 0.3 pad 0.64, 0.38 pad 0.81)
  Top 0.406: Q9.3 23.75,22.61 v23.88,22.48
  Top 1.016: Q9.3 18.41,22.61 F2.2 v15.75,21.59 14.86,21.59 14.48,21.21 14.48,21.11 D2.2
  Bottom 0.406: T_USB.T 24.26,22.1 v23.88,22.48
  Bottom 1.016: v15.75,21.59 15.75,22.1 Q2.3
N$19
  Top 0.152: U5.7 43.26,38.41 43.26,38.99 44.07,39.8 44.07,44.63 43.61,45.09 32.39,45.09 C42.2
  Top 0.203: C42.2 31.5,44.32
  Top 0.305: R_USB.1 31.5,44.32
N$20
  Top 0.152: U5.62 42.92,23.5 43.61,22.81 43.61,21.21
  Top 0.203: 43.61,21.21 43.61,20.9 44.83,19.68 49.72,19.68 50.1,19.3 51.92,19.3 R4.2
N$21
  Top 0.152: U5.60 40.12,23.38 40.83,22.67 40.83,21.21 40.83,21.14
  Top 0.203: 40.83,21.21 40.83,20.64 43.31,18.16 R9.2
N$22
  Top 0.152: U5.61 41.52,23.45 42.22,22.76 42.22,21.21
  Top 0.203: 42.22,21.21 42.22,20.9 43.82,19.3 49.53,19.3 49.91,18.92 51.61,18.92 52.32,18.21 52.32,17.4 R13.2
N$26  (via drill 0.38 pad 0.81)
  Top 1.016: D5.2 11.56,20.32 v13.08,20.32 | v10.03,6.6 11.05,5.59 D11.2 11.05,2.29 10.16,1.4 J2.+
  VCC 1.016: v13.08,20.32 10.03,17.27 v10.03,6.6
  Bottom 0.406: R6.2 R8.2 12.7,9.27 v10.03,6.6
N$27
  Bottom 0.203: U10.1 17.59,17.84 14.86,15.11 R45.2
N$29
  Top 0.254: R26.1 NET.-
N$30
  Top 0.203: L5.1 R19.2 C30.2
N$31
  Top 0.254: R18.2 PWR1.+
N$33  (via drill 0.3 pad 0.64)
  Top 0.152: U5.20 38.76,23.67 39.42,23.01 39.42,21.25 39.42,20.73 42.04,18.11 v42.04,17.04 | v55.91,14.61 55.14,14.61 R40.2
  Top 0.203: 39.42,21.25 39.42,20.78 42.04,18.16 42.04,17.02
  VCC 0.203: v42.04,17.04 43.41,15.67 43.41,13.54 43.99,12.95 44.86,12.95 45.24,13.34 49.3,13.34 50.52,14.55 55.86,14.55 v55.91,14.61
N$34
  Top 0.203: U5.25 44.32,21.03 44.32,20.95 45.21,20.07 49.85,20.07 50.23,19.68 52.81,19.68 54.38,18.11 54.38,13.87 R41.2
N$35
  Top 0.203: U5.22 40.12,20.71 42.65,18.19 42.65,16.78 42,16.13 R42.2
N$36
  Bottom 0.305: Q8.3 11.3,20.95 R43.1 12.95,21.97 Q2.1
N$37
  Bottom 0.254: Q4.1 16,18.29 R45.1
N$38
  Top 0.152: X1.2 45.85,17.4 47.24,16 C5.2 47.94,14.41 47.94,13.06 U3.17
N$39
  Top 0.254: PWR2.- R49.2
N$40
  Top 0.203: R50.1 24.27,11.54 24.27,13.73 26.16,15.62 U6.7
N$41
  Top 0.152: X1.1 49.66,17.02 49.66,16.89 48.9,16.13 C18.2 48.32,14.54 48.32,13.05 U3.16
N$42
  Top 0.203: TX.- R53.2
N$43  (via drill 0.38 pad 0.81)
  Top 0.305: R50.2 C48.2
  Top 0.813: C36.+ 28.45,9.4 27.94,9.91
  Top 1.016: U6.2 26.16,11.18 C48.2 26.54,10.79
  Top 1.524: D2.1 D5.1 10.45,23.88 v9.78,23.88
  VCC 1.016: v9.78,23.88 15.38,23.88 17.02,22.24 17.02,15.25 18.04,14.22 23.62,14.22 v27.88,9.97
  Bottom 1.524: Q2.2 12.95,23.49 R43.2 10.16,23.49 v9.78,23.88
  pour Top (isolate 0.254, no thermals): 25.78,11.56 30.23,11.56 arc-90 30.86,10.92 30.86,8.76 arc-90 30.23,8.13 28.07,8.13 arc-90 27.43,8.76 27.43,9.65 arc90 26.8,10.29 25.78,10.29
N$44
  Top 0.203: R52.1 R51.2 C8.1 U6.5
N$45
  Top 2.032: L7.1 34.23,15.31 37.72,18.8 38.18,18.8 D9.-
  pour Top (isolate 0.254, no thermals): 27.05,16.26 27.05,12.19 arc90 27.18,12.07 27.94,12.07 arc90 28.07,12.19 28.07,13.59 arc-90 28.45,13.97 34.16,13.97 arc90 34.54,14.35 34.54,16.26 arc90 34.16,16.64 27.43,16.64 arc90
N$46
  Top 0.203: RX.- R54.2
N$47
  Top 0.152: R55.1 L1.+
N$56
  Top 0.203: R27.2 54.99,46.99 50.8,46.99 Q7.3
N$57
  Top 0.254: STA.- 59.56,48.51 58.04,48.51 R27.1
N$58
  Top 0.254: L21.1 C27.2 66.75,21.97 BT_ANT.1
N$59
  Top 0.254: R24.1 C31.2 ANT2.D
NETLIGHT  (via drill 0.3 pad 0.64)
  Top 0.152: U5.64 45.72,23.39 45.03,22.71 45.03,21.21
  Top 0.203: 45.03,21.21 45.03,20.88 45.47,20.45 50.36,20.45 v50.48,20.32 | R31.2 v41.15,46.36
  Bottom 0.203: v41.15,46.36 41.91,45.59 55.37,45.59 56.52,44.45 56.52,40.64 50.67,34.8 50.67,20.51 v50.48,20.32
PB4/A8/D8  (via drill 0.3 pad 0.64)
  Top 0.152: U3.28 43.8,9.64 43.59,9.42 42.43,9.42 v42.19,9.18
  VCC 0.203: v42.19,9.18 42.1,9.18 41.58,8.66 41.58,7.44 42.6,6.43 49.86,6.43 50.93,7.49 52.27,7.49 v54.09,5.68
  Bottom 0.152: J9.1 41.78,50.16 38.38,46.76 38.38,22.53 40.51,20.4 40.51,13.54 41.43,12.62 41.43,9.94 v42.19,9.18
  Bottom 0.203: v54.09,5.68 54.09,6.08 R_D8.1
PB5/A9/D9  (via drill 0.3 pad 0.64)
  Top 0.152: R3.1 32.79,46.36 33.5,47.07 36.86,47.07 37.01,47.22 37.01,47.98 37.31,48.29 38.66,48.29 v38.71,48.23 | U3.29 43.74,9.14 43.41,8.81 v42.95,8.81
  Bottom 0.152: J9.2 38.71,50.39 v38.71,48.23 38.71,47.55 38.08,46.91 38.08,22.38 40.21,20.24 40.21,13.39 41.12,12.47 41.12,9.38 42,8.51 42.65,8.51 v42.95,8.81
PB6/A10/D10  (via drill 0.3 pad 0.64)
  Top 0.152: 6.65,52.25 R12.2 v7.75,52.2 | U3.30 43.69,8.64 42.95,7.9 v42.34,7.9
  Bottom 0.152: v42.34,7.9 42.11,7.9 40.82,9.2 40.82,12.32 39.9,13.23 39.9,20.09 37.77,22.22 37.77,46.91 36.7,47.98 J9.3 36.7,51.03 35.48,52.25 23.44,52.25 22.83,51.64 22.83,47.6 21.57,46.33 13.61,46.33 v7.75,52.2
PB7/D11  (via drill 0.3 pad 0.64)
  Top 0.203: v50.78,13.13 50.52,13.13 U3.12
  VCC 0.203: v40.21,11.86 41.94,11.86 43.22,10.58 43.74,10.58 45.69,12.52 50.16,12.52 v50.78,13.13
  Bottom 0.152: J9.4 34.16,50.06 37.47,46.76 37.47,22.07 39.6,19.94 39.6,13.08 40.21,12.47 v40.21,11.86 | 55.93,19.51 56.67,18.77 56.67,15.77 56.26,15.37 54.61,15.37 54.36,15.11 54.36,13.51 53.47,12.62 52.34,12.62 51.62,13.34 51.05,13.34 50.85,13.13 v50.78,13.13
  Bottom 0.203: 56.13,19.3 55.93,19.51 D4.+
PC7/D13  (via drill 0.3 pad 0.64)
  Top 0.152: R55.2 29.46,48.51 v29.39,48.59 | U3.32 43.91,7.64 43.71,7.44 43.71,6.83 43.41,6.53 42.8,6.53 42.04,7.29 v40.66,7.29
  Bottom 0.152: J9.6 29.08,48.9 v29.39,48.59 29.59,48.39 34.93,48.39 36.86,46.46 36.86,21.77 38.99,19.63 38.99,12.78 39.29,12.47 39.29,8.66 v40.66,7.29
PD0/SCL/D3  (via drill 0.3 pad 0.64)
  Top 0.152: U3.18 47.38,13.98 v47.37,13.97 | v52.86,15.37 R40.1 | J5.4 54.61,52.32 20.32,52.32 J9.10
  Bottom 0.152: J5.4 56.01,48.95 57.28,47.68 57.28,40.21 51.49,34.42 51.49,19.1 53.01,17.58 53.01,15.52 v52.86,15.37 53.62,14.61 53.62,13.69 53.16,13.23 52.64,13.23 51.73,14.15 47.52,14.15 47.37,14 v47.37,13.97
PD1/SDA/D2  (via drill 0.3 pad 0.64)
  Top 0.152: U3.19 46.88,13.57 46.61,13.84 v46.61,14.22 | R13.1 55.96,16.08 v56.06,15.98 | J5.3 57.28,49.66 22.73,49.66 J9.9
  Bottom 0.152: J5.3 58.55,48.79 57.58,47.83 57.58,40.06 51.79,34.27 51.79,19.26 53.92,17.13 53.92,16.28 | v46.61,14.22 46.61,13.84 47.07,13.39 47.68,13.39 47.98,13.69 51.73,13.69 52.49,12.93 53.32,12.93 53.92,13.54 53.92,15.98 | 54.08,16.13 55.91,16.13 v56.06,15.98 | 54.08,16.13 53.92,15.98 | 53.92,15.98 53.92,16.28 | 54.08,16.13 53.92,16.28
PD2/RXI/D0  (via drill 0.3 pad 0.64)
  Top 0.152: U3.20 46.38,13.62 45.85,14.15 44.93,14.15 v44.56,14.52
  Top 0.203: v60.94,6.38 61.09,6.53 61.09,9.12 57.25,12.95 57.25,16.59 56.27,17.58 R4.1 55.14,17.6 55.14,18.21 v53.29,20.07
  VCC 0.203: v53.29,20.07 53.29,18.57 50.09,15.37 45.44,15.37 44.59,14.52 v44.56,14.52
  Bottom 0.203: J5.1 59.31,46.61 59.31,40.77 52.58,34.04 52.58,20.5 53.01,20.07 v53.29,20.07 | v60.94,6.38 59.97,6.38 R_RX.1
PD3/TXO/D1  (via drill 0.3 pad 0.64)
  Top 0.152: U3.21 45.88,13.66 45.7,13.84 44.73,13.84 v44.56,13.67 44.24,13.67 R9.1 | v56.06,16.89 56.82,16.13 56.82,12.47 v60.48,8.81
  VCC 0.203: v44.56,13.67 44.76,13.67 46.05,14.96 50.32,14.96 52.25,16.89 v56.06,16.89
  Bottom 0.152: v60.48,8.81 60.48,8.53 R_TX.1
  Bottom 0.203: J5.2 58.93,48.77 58.93,40.89 52.2,34.16 52.2,19.43 54.74,16.89 v56.06,16.89
PD4/A6/D4  (via drill 0.3 pad 0.64)
  Top 0.152: v52.85,13.84 52.88,13.84 R41.1
  Top 0.254: U3.25 43.52,11.14 v43.46,11.2
  VCC 0.203: v52.85,13.84 50.42,13.84 49.51,12.93 45.44,12.93 43.71,11.2 v43.46,11.2
  Bottom 0.152: J5.5 53.47,50.88 56.97,47.37 56.97,40.36 51.18,34.57 51.18,18.95 52.25,17.88 52.25,14.44 | 52.25,14.44 v52.85,13.84 | 52.23,14.45 52.25,14.44
PD5/TXLED  (via drill 0.3 pad 0.64)
  Top 0.152: R53.1 13.03,35.43 v13.23,35.64 | U3.22 44.39,12.99 43.54,13.84 41.58,13.84 40.6,12.87 37.56,12.87 v37.47,12.78
  Bottom 0.152: v13.23,35.64 14.45,34.42 14.45,31.83 17.35,28.93 29.39,28.93 31.22,27.1 31.22,19.02 v37.47,12.78
PD6/A11/D12  (via drill 0.3 pad 0.64)
  Top 0.152: v39.9,11.1 42.49,11.1 42.95,10.64 U3.26 | R32.1 45.72,49.28 33.78,49.28 v33.53,49.02
  Top 0.203: R32.1 48.51,47.88 Q7.1
  Top 0.254: R35.1 53.98,47.88 53.09,48.77 49.4,48.77 Q7.1
  Bottom 0.152: v39.9,11.1 39.6,11.41 39.6,12.62 39.29,12.93 39.29,19.79 37.16,21.92 37.16,46.61 34.75,49.02 v33.53,49.02 J9.5
PD6/D5  (via drill 0.3 pad 0.64)
  Top 0.152: v42.34,14.61 R42.1 | U3.31 43.65,8.14 43.16,7.64 v43.16,7.11
  Bottom 0.152: 41.43,14.76 41.43,20.85 39.29,22.99 39.29,46.3 40.51,47.52 47.52,47.52 J5.6 | 41.43,14.76 41.43,14.45 | 41.43,14.45 41.43,14 42.34,13.08 42.34,11.5 43.2,10.64 43.41,10.64 43.87,10.19 43.87,7.82 v43.16,7.11 | v42.34,14.61 41.58,14.61 | 41.58,14.61 41.43,14.76 | 41.58,14.61 41.43,14.45
PD7/A7/D6  (via drill 0.3 pad 0.64)
  Top 0.152: R16.2 41.43,9.99 42.9,9.99 v42.94,10.03 43.05,10.14 U3.27
  Bottom 0.152: J5.7 48.39,50.67 45.54,47.83 40.36,47.83 38.99,46.46 38.99,22.83 41.12,20.7 41.12,13.84 42.04,12.93 42.04,10.93 v42.94,10.03
PE6/D7  (via drill 0.3 pad 0.64)
  Top 0.152: U3.1 51.49,7.14 v51.79,6.83 51.94,6.83 52.31,7.2 54.14,7.2 v54.38,7.44
  Bottom 0.152: J5.8 45.85,49.35 44.63,48.13 40.21,48.13 38.68,46.61 38.68,22.68 40.82,20.55 40.82,13.69 41.73,12.78 41.73,10.45 42.76,9.42 43.27,9.42 43.56,9.13 43.56,8.29 42.49,7.23 42.49,6.83 42.95,6.38 51.33,6.38 v51.79,6.83 | 54.18,7.44 v54.38,7.44 53.98,7.85 R_D7.1
PF0/A5
  Top 0.152: U3.41 48.88,5.59 49.39,5.08 61.21,5.08 J8.6
PF1/A4
  Top 0.152: U3.40 48.38,5.62 49.24,4.76 58.99,4.76 J8.5
PF4/A3
  Top 0.152: U3.39 47.88,5.61 49.05,4.44 56.77,4.44 J8.4
PF5/A2
  Top 0.152: U3.38 47.38,5.6 48.86,4.13 54.55,4.13 J8.3
PF6/A1
  Top 0.152: U3.37 46.88,5.57 48.64,3.81 52.32,3.81 J8.2
PF7/A0
  Top 0.152: U3.36 46.38,5.59 48.54,3.43 50.16,3.43 J8.1
PWRKEY
  Top 0.152: U5.48 44.32,36.58 43.62,37.28 43.62,38.93 44.39,39.69 44.39,44.74 43.74,45.39 39.69,45.39 Q1.3
SIM_CLK
  Top 0.152: U5.55 40.13,30.67 39.51,31.29 arc45 39.33,31.37 37.85,31.37
  Top 0.203: 37.85,31.37 37.27,31.37 arc-45 36.95,31.5 R29.1
SIM_CTS  (via drill 0.3 pad 0.64)
  Top 0.203: 52.89,26.54 U5.34 53,26.29 v53.85,26.29
  Bottom 0.203: J13.4 59.18,31.88 55.37,31.88 54.42,30.92 54.42,26.86 v53.85,26.29
SIM_DATA
  Top 0.203: U5.14 37.22,32.07 arc-45 36.87,32.21 35.2,33.89 arc-45 35.05,34.25 35.05,34.71 arc45 34.9,35.08 R28.2 C40.2
SIM_DCD  (via drill 0.3 pad 0.64)
  Top 0.152: U5.70 51.36,26.47 52.07,27.18 v53.85,27.18
  Top 0.203: v53.85,31.88 56.26,31.88 56.64,31.5 56.64,26.8 J11.4
  Bottom 0.203: v53.85,27.18 v53.85,31.88
SIM_DTR  (via drill 0.3 pad 0.64)
  Top 0.152: U5.69 51.26,25.07 51.94,24.38 v53.85,24.38
  Top 0.203: J11.3 59.18,26.8 v59.18,22.99
  Bottom 0.203: J11.3 56.64,28.07 56.13,27.56 56.13,26.67 v53.85,24.38 | v59.18,22.99 59.18,21.97 59.31,21.84 R56.2 R57.1
SIM_PWM  (via drill 0.3 pad 0.64)
  Top 0.203: U5.26 45.72,21.14 45.97,20.89 v53.15,20.89
  Bottom 0.203: J11.1 57.15,33.91 53.59,33.91 52.96,33.27 52.96,21.08 v53.15,20.89
SIM_RI  (via drill 0.3 pad 0.64)
  Top 0.152: U5.68 51.32,23.48 51.82,22.99 54.1,22.99 54.99,23.88 v54.99,27.43
  Bottom 0.203: v54.99,27.43 54.99,29.97 55.63,30.61 J11.2
SIM_RST
  Top 0.203: U5.15 37.33,30.67 arc-45 37.01,30.8 34.93,32.89 arc45 34.61,33.02 R30.1
SIM_RTS  (via drill 0.3 pad 0.64)
  Top 0.203: 52.89,25.15 U5.33 53.02,25.27 v53.85,25.27
  Bottom 0.203: J13.3 59.18,29.34 56.39,29.34 55.75,28.7 55.75,27.18 v53.85,25.27
SIM_RXD  (via drill 0.3 pad 0.64)
  Top 0.203: v54.48,22.35 52.9,22.35 U5.31
  Bottom 0.203: J13.1 59.18,24.26 55.2,24.26 54.48,23.54 v54.48,22.35 55.22,21.61 56.21,21.61 57.15,20.68 57.15,14.16 R25.4 57.98,11.49 Q5.2
SIM_TXD  (via drill 0.3 pad 0.64)
  Top 0.152: v53.85,21.46 53.85,20.14 55.72,18.26 v59.11,18.26
  Top 0.203: v53.85,23.56 52.93,23.56 U5.32
  Bottom 0.203: J13.2 59.18,26.8 57.09,26.8 v53.85,23.56 v53.85,21.46 | R25.6 58.8,15.62 59.18,16 59.18,18.19 v59.11,18.26 58.95,18.41 Q3.2 58.17,18.16 58.04,18.03
SIM_VBAT  (via drill 0.3 pad 0.64)
  Top 0.254: C46.2 54.74,43.18 54.74,44.58 55.37,45.21 57.79,45.21 NET.+ STA.+ 60.45,46.23 61.21,45.47 63.5,45.47 PWR2.+
  VCC 2.032: v28.64,22.8 31.3,22.8 37.85,29.34 37.85,37.48 41.9,41.53 v46.1,41.53 46.36,41.53
  Bottom 0.406: T_VBAT.T 46.86,42.04 v46.74,42.16
  other vias: 45.47,40.89 45.47,42.16 46.74,40.89 29.21,22.35 29.21,23.24 28.07,23.24 28.07,22.35
  pour Top (isolate 0.254, no thermals): 50.93,40.26 50.93,37.47 arc90 51.18,37.21 53.72,37.21 arc90 53.98,37.47 53.98,42.29 arc90 53.72,42.55 49.66,42.55 arc-90 49.4,42.8 49.4,43.31 arc90 49.15,43.56 45.34,43.56 arc90 45.09,43.31 45.09,40.77 arc90 45.34,40.51 50.67,40.51 arc-90
  pour Top (isolate 0.254, no thermals): 26.67,20.95 30.48,20.95 arc-90 31.11,20.32 31.11,19.94 arc90 31.5,19.56 34.16,19.56 arc90 34.54,19.94 34.54,22.99 arc90 33.91,23.62 27.3,23.62 arc90 26.67,22.99
SIM_VRTC  (via drill 0.38 pad 0.64)
  Top 0.152: U5.56 40.19,29.27 39.5,28.57 37.34,28.57
  Top 1.016: 37.34,28.57 37.08,28.57 36.45,29.21 C1.2 34.16,29.34 v34.16,30.23
  Bottom 1.016: v34.16,30.23 34.16,23.57 J1.+
SIM_VSIM  (via drill 0.3 pad 0.64)
  Top 0.254: U5.16 arc45 38.46,29.34 37.85,29.34 36.25,30.93 arc45 35.8,31.11 29.76,31.11 arc-45 29.25,31.32 C41.2
  Top 0.305: U7.5 28.07,32.51 C41.2
  Top 0.406: v27.05,32.39 C41.2
  Bottom 0.61: SIM1.1 21.43,41.87 20.7,41.15 20.7,34.54 22.86,32.39 v27.05,32.39
SPK_N
  Top 0.152: 36.7,35.21 36.7,35.04 arc45 36.78,34.86 37.93,33.71 arc45 38.05,33.66 38.44,33.66 U5.13
  Top 0.203: L2.1 C21.1 C15.2 C22.1 C16.2 | 36.7,35.21 36.7,39.14 arc90 34.7,41.14 28.81,41.14 arc-45 28.2,41.39 26.15,43.44 arc45 25.25,43.82 arc45 24.85,43.65 C16.2 | 24.64,43.18 C16.2
SPK_P
  Top 0.152: 37.21,35.28 37.21,35.06 arc45 37.32,34.8 37.87,34.25 arc45 38.08,34.16 39.4,34.16 arc-45 39.62,34.07 U5.53
  Top 0.203: L3.1 C21.2 C23.1 C22.2 C24.1 24.98,44.36 arc45 25.38,44.2 arc-45 26.28,43.82 28.39,41.71 arc45 28.77,41.55 34.69,41.55 arc-90 37.21,39.04 37.21,35.28
STATUS
  Top 0.152: U5.4 47.12,38.22 47.12,38.23 47.12,38.73 46.99,38.86 45.72,38.86 44.7,39.88 44.7,43.94 R32.2 46.99,46.23 47.12,46.1
U5V  (via drill 0.3 pad 0.64, 0.38 pad 0.64, 0.38 pad 0.81)
  Top 0.305: J4.1 4.83,33.81 | 4.83,33.81 5.18,33.81 5.21,33.78 5.21,34.04 | 4.44,34.16 4.47,34.16 4.83,33.81 | U3.2 52.75,7.64 v53.92,8.81 52.6,10.14 U3.7
  Top 1.016: 4.44,34.16 v5.97,34.16 | F2.1 17.4,25.48 v17.2,25.68
  VCC 1.016: v53.92,8.81 54.69,8.81 55.44,8.06 55.44,5.57 54.41,4.55 40.82,4.55 37.62,7.75 37.62,11.12 33.98,14.76 29.39,14.76 18.47,25.68 v17.2,25.68
  Bottom 1.016: v5.97,34.16 C33.1 C34.1 6.98,29.08 8.13,27.94 14.94,27.94 v17.2,25.68
UCAP  (via drill 0.3 pad 0.64)
  Top 0.203: U3.6 52.05,9.64 v52.2,9.5
  Bottom 0.152: 53.82,11.53 53.95,11.53 C4.2
  Bottom 0.203: v52.2,9.5 52.5,9.8 R47.2 53.82,11.53
USB_D+  (via drill 0.3 pad 0.64)
  Top 0.254: D13.2 v9.78,32.26 10.54,32.26 R37.2 11.43,31.37 11.43,29.6 10.76,28.93 6.73,28.93 5.97,29.69 5.97,32.26 5.71,32.51 J4.3
  Bottom 0.203: R22.1 9.78,33.15 v9.78,32.26
USB_D-  (via drill 0.3 pad 0.64)
  Top 0.254: R36.2 10.54,30.48 v9.91,30.48 D13.1 7.87,31.5 7.87,32.26 7.62,32.51 6.48,32.51 5.83,33.16 J4.2
  Bottom 0.203: R33.1 10.79,31.37 v9.91,30.48
VCC  (via drill 0.3 pad 0.64)
  Top 0.152: C51.2 53.38,6.44
  Top 0.203: v51.49,15.21 51.49,15.19 C50.2 | v43,12.9 43,12.24 C49.2 | R48.1 v24.77,5.97 R11.1 | R18.1 v12.45,3.56
  Top 0.254: R15.1 v7.75,50.29 | U3.24 43.93,11.64 43.56,12.01 43.1,12.01 42.93,12.19 C49.2 | U3.34 45.39,6.28 45.39,5.92 45.11,5.64 C52.2 41.89,6.68 v41.28,6.68 | U3.14 49.38,14.02 49.66,14.3 51.71,14.3 C50.2
  Top 0.305: 53.15,6.29 C51.2 | 53.47,6.53 53.38,6.44 52.93,5.99 v51.84,5.99 51.74,5.99 51.44,6.3 50.39,6.3 U3.44
  Top 0.406: v6.73,35.43 TX.+ RX.+
  VCC 0.254: v41.28,6.68 41.28,6.48 42.04,5.71 50.04,5.71 50.8,6.48 51.26,6.48 51.66,6.07 51.77,6.07 v51.84,5.99
  Bottom 0.152: v60,15.6 60.17,15.6 60.2,15.62
  Bottom 0.203: R25.7 59.56,15.44 59.74,15.62 60.2,15.62 60.39,15.43 R25.8
  pour VCC (isolate 0.254, no thermals): 0.13,54.1 66.8,54.1 66.8,43.31 60.96,43.31 60.96,38.23 69.98,38.23 69.98,24.26 64.9,24.26 64.9,9.65 69.98,9.65 69.98,0.13 0.13,0.13
VEXT  (via drill 0.3 pad 0.64)
  Top 0.152: v56.45,5.64 56.54,5.64 57.12,6.22 57.12,6.68 56.67,7.14 56.67,9.12 v57.12,9.58
  Bottom 0.152: v57.12,9.58 58.12,9.58 Q5.1
  Bottom 0.203: Q3.1 57.98,16.45 R25.5 57.98,14.67 58.67,13.97 58.67,13.46 R25.3 58.8,12.45 59.18,12.07 59.18,10.41 58.29,9.53 Q5.1
  Bottom 0.305: R1.1 29.46,24.38 29.59,24.38 29.91,24.07 29.91,18.03 37.59,10.35 37.59,7.49 40.39,4.7 49.66,4.7 50.33,4.02 54.84,4.02 v56.45,5.64
  Bottom 0.33: C2.2 27.48,26.11 28.83,24.77 29.27,24.77 R1.1
  Bottom 0.406: C2.2 25.96,26.11 25.91,26.16 | 25.91,26.16 D3.- | 25.91,26.16 T_2V8.T

## Text on the board
tPlace: 3V3_VCC_5V
bPlace: 13 | 12 | 11 | 10 | 9 | 8 | 7 | 6 | 5 | 4 | 3 | 2 | 1 | 0 | SCL | SDA | GND | AREF | DIGITAL | Seeeduino GPRS | SIM | V1.0a2 12/20/2013 | by Seeed Studio | www.seeedstudio.com | PWM | CTS | VCC | RI | RTS | MISO | DTR | TXD | SCK | MOSI | DCD | RXD | RST | GND | CR1220 | IOREF | RST | 3V3 | 5V | GND | GND | VIN | A0 | A1 | A2 | A3 | A4 | A5 | 9V<-->12V